# Altium schematic sheet IowaStateLEDSch.SchDoc
size A
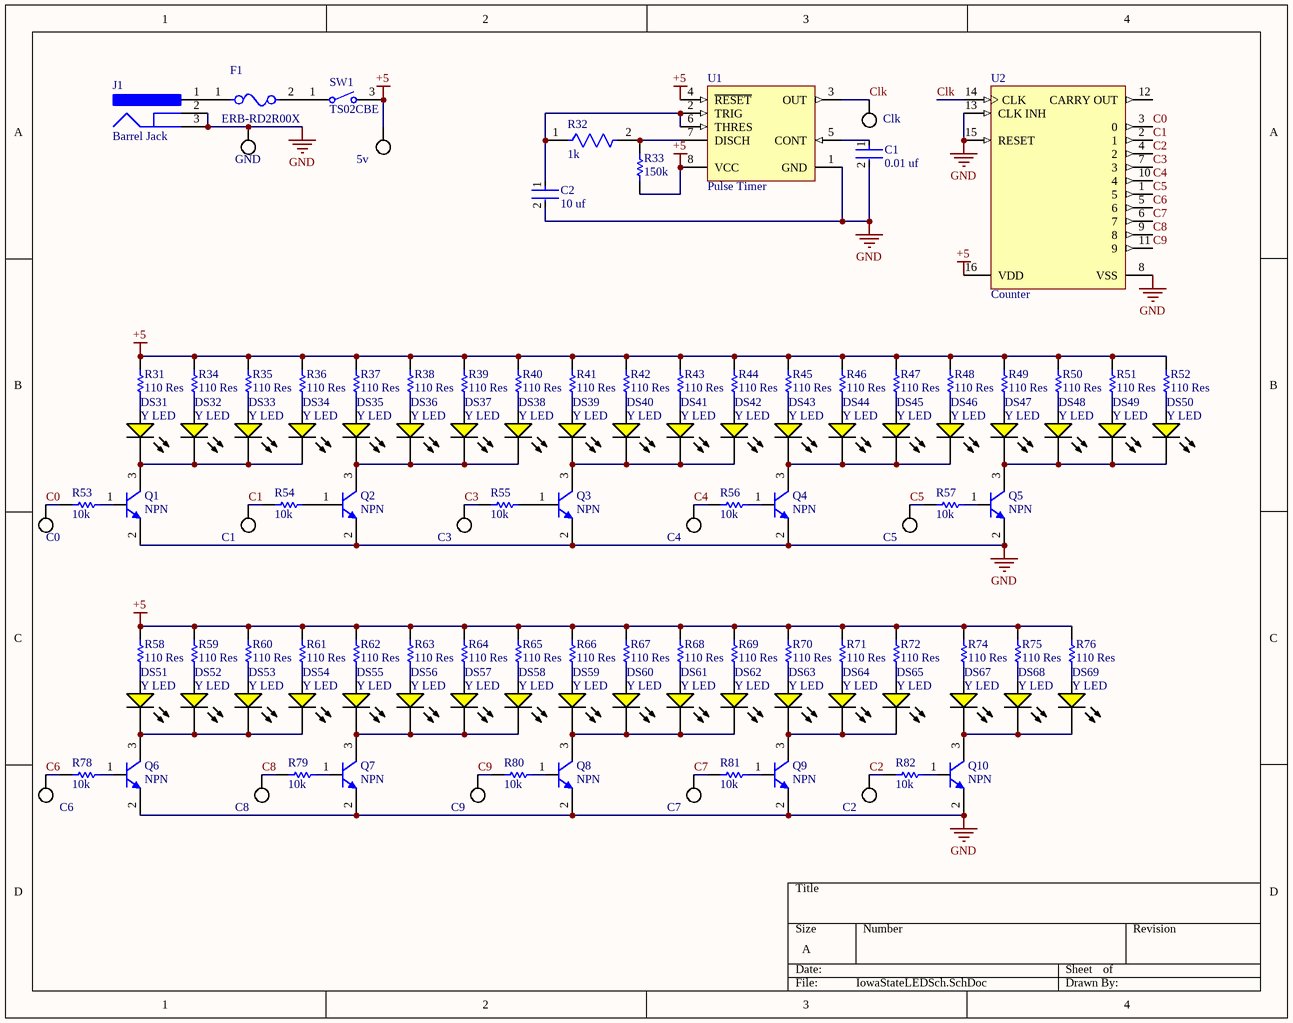
[diagram p0: IowaStateLEDSch.SchDoc]

## Parts
(Parts that share a designator on the sheet are numbered #1, #2 ... from top to bottom, then left to right.)
5v  EPAD  [EPAD]  (value not drawn)  (no BOM)
C0  EPAD  [EPAD]  (value not drawn)  (no BOM)
C1#1  0.01 uf  [FP-C1206C-EB-MFG]
C1#2  EPAD  [EPAD]  (value not drawn)  (no BOM)
C2#1  10 uf  [FP-CL21-IPC_C]
C2#2  EPAD  [EPAD]  (value not drawn)  (no BOM)
C3  EPAD  [EPAD]  (value not drawn)  (no BOM)
C4  EPAD  [EPAD]  (value not drawn)  (no BOM)
C5  EPAD  [EPAD]  (value not drawn)  (no BOM)
C6  EPAD  [EPAD]  (value not drawn)  (no BOM)
C7  EPAD  [EPAD]  (value not drawn)  (no BOM)
C8  EPAD  [EPAD]  (value not drawn)  (no BOM)
C9  EPAD  [EPAD]  (value not drawn)  (no BOM)
Clk  EPAD  [EPAD]  (value not drawn)  (no BOM)
DS31  Y LED  [LTST-C150KSKT_V]
DS32  Y LED  [LTST-C150KSKT_V]
DS33  Y LED  [LTST-C150KSKT_V]
DS34  Y LED  [LTST-C150KSKT_V]
DS35  Y LED  [LTST-C150KSKT_V]
DS36  Y LED  [LTST-C150KSKT_V]
DS37  Y LED  [LTST-C150KSKT_V]
DS38  Y LED  [LTST-C150KSKT_V]
DS39  Y LED  [LTST-C150KSKT_V]
DS40  Y LED  [LTST-C150KSKT_V]
DS41  Y LED  [LTST-C150KSKT_V]
DS42  Y LED  [LTST-C150KSKT_V]
DS43  Y LED  [LTST-C150KSKT_V]
DS44  Y LED  [LTST-C150KSKT_V]
DS45  Y LED  [LTST-C150KSKT_V]
DS46  Y LED  [LTST-C150KSKT_V]
DS47  Y LED  [LTST-C150KSKT_V]
DS48  Y LED  [LTST-C150KSKT_V]
DS49  Y LED  [LTST-C150KSKT_V]
DS50  Y LED  [LTST-C150KSKT_V]
DS51  Y LED  [LTST-C150KSKT_V]
DS52  Y LED  [LTST-C150KSKT_V]
DS53  Y LED  [LTST-C150KSKT_V]
DS54  Y LED  [LTST-C150KSKT_V]
DS55  Y LED  [LTST-C150KSKT_V]
DS56  Y LED  [LTST-C150KSKT_V]
DS57  Y LED  [LTST-C150KSKT_V]
DS58  Y LED  [LTST-C150KSKT_V]
DS59  Y LED  [LTST-C150KSKT_V]
DS60  Y LED  [LTST-C150KSKT_V]
DS61  Y LED  [LTST-C150KSKT_V]
DS62  Y LED  [LTST-C150KSKT_V]
DS63  Y LED  [LTST-C150KSKT_V]
DS64  Y LED  [LTST-C150KSKT_V]
DS65  Y LED  [LTST-C150KSKT_V]
DS67  Y LED  [LTST-C150KSKT_V]
DS68  Y LED  [LTST-C150KSKT_V]
DS69  Y LED  [LTST-C150KSKT_V]
F1  ERB-RD2R00X  [FP-ERBRD-MFG]
GND  EPAD  [EPAD]  (value not drawn)  (no BOM)
J1  Barrel Jack  [KYCN-KLDX-0202-A_V]
Q1  NPN  [DIOD-SOT23-3_V]
Q2  NPN  [DIOD-SOT23-3_V]
Q3  NPN  [DIOD-SOT23-3_V]
Q4  NPN  [DIOD-SOT23-3_V]
Q5  NPN  [DIOD-SOT23-3_V]
Q6  NPN  [DIOD-SOT23-3_V]
Q7  NPN  [DIOD-SOT23-3_V]
Q8  NPN  [DIOD-SOT23-3_V]
Q9  NPN  [DIOD-SOT23-3_V]
Q10  NPN  [DIOD-SOT23-3_V]
R31  110 Res  [RESC3216X70X50LL05T20]
R32  1k  [FP-CR1206-IPC_C]
R33  150k  [RESC3216X70X40LL20T20]
R34  110 Res  [RESC3216X70X50LL05T20]
R35  110 Res  [RESC3216X70X50LL05T20]
R36  110 Res  [RESC3216X70X50LL05T20]
R37  110 Res  [RESC3216X70X50LL05T20]
R38  110 Res  [RESC3216X70X50LL05T20]
R39  110 Res  [RESC3216X70X50LL05T20]
R40  110 Res  [RESC3216X70X50LL05T20]
R41  110 Res  [RESC3216X70X50LL05T20]
R42  110 Res  [RESC3216X70X50LL05T20]
R43  110 Res  [RESC3216X70X50LL05T20]
R44  110 Res  [RESC3216X70X50LL05T20]
R45  110 Res  [RESC3216X70X50LL05T20]
R46  110 Res  [RESC3216X70X50LL05T20]
R47  110 Res  [RESC3216X70X50LL05T20]
R48  110 Res  [RESC3216X70X50LL05T20]
R49  110 Res  [RESC3216X70X50LL05T20]
R50  110 Res  [RESC3216X70X50LL05T20]
R51  110 Res  [RESC3216X70X50LL05T20]
R52  110 Res  [RESC3216X70X50LL05T20]
R53  10k  [RESC3116X65X50NL20T20]
R54  10k  [RESC3116X65X50NL20T20]
R55  10k  [RESC3116X65X50NL20T20]
R56  10k  [RESC3116X65X50NL20T20]
R57  10k  [RESC3116X65X50NL20T20]
R58  110 Res  [RESC3216X70X50LL05T20]
R59  110 Res  [RESC3216X70X50LL05T20]
R60  110 Res  [RESC3216X70X50LL05T20]
R61  110 Res  [RESC3216X70X50LL05T20]
R62  110 Res  [RESC3216X70X50LL05T20]
R63  110 Res  [RESC3216X70X50LL05T20]
R64  110 Res  [RESC3216X70X50LL05T20]
R65  110 Res  [RESC3216X70X50LL05T20]
R66  110 Res  [RESC3216X70X50LL05T20]
R67  110 Res  [RESC3216X70X50LL05T20]
R68  110 Res  [RESC3216X70X50LL05T20]
R69  110 Res  [RESC3216X70X50LL05T20]
R70  110 Res  [RESC3216X70X50LL05T20]
R71  110 Res  [RESC3216X70X50LL05T20]
R72  110 Res  [RESC3216X70X50LL05T20]
R74  110 Res  [RESC3216X70X50LL05T20]
R75  110 Res  [RESC3216X70X50LL05T20]
R76  110 Res  [RESC3216X70X50LL05T20]
R78  10k  [RESC3116X65X50NL20T20]
R79  10k  [RESC3116X65X50NL20T20]
R80  10k  [RESC3116X65X50NL20T20]
R81  10k  [RESC3116X65X50NL20T20]
R82  10k  [RESC3116X65X50NL20T20]
SW1  TS02CBE  [CKCP-TS02CBE_V]
U1  Pulse Timer  [D0008A_M]
U2  Counter  [D0016A_L]

## Nets
+5: 5v.1 R31.1 R33.1 R34.1 R35.1 R36.1 R37.1 R38.1 R39.1 R40.1 R41.1 R42.1 R43.1 R44.1 R45.1 R46.1 R47.1 R48.1 R49.1 R50.1 R51.1 R52.1 R58.1 R59.1 R60.1 R61.1 R62.1 R63.1 R64.1 R65.1 R66.1 R67.1 R68.1 R69.1 R70.1 R71.1 R72.1 R74.1 R75.1 R76.1 SW1.3 U1.4(~{RESET}) U1.8(VCC) U2.16(VDD)
GND: C1#1.2 C2#1.2 GND.1 J1.2 J1.3 Q1.2(E) Q2.2(E) Q3.2(E) Q4.2(E) Q5.2(E) Q6.2(E) Q7.2(E) Q8.2(E) Q9.2(E) Q10.2(E) U1.1(GND) U2.8(VSS) U2.13(CLK_INH) U2.15(RESET)
C0: C0.1 R53.1 U2.3(0)
C1: C1#2.1 R54.1 U2.2(1)
C2: C2#2.1 R82.1 U2.4(2)
C3: C3.1 R55.1 U2.7(3)
C4: C4.1 R56.1 U2.10(4)
C5: C5.1 R57.1 U2.1(5)
C6: C6.1 R78.1 U2.5(6)
C7: C7.1 R81.1 U2.6(7)
C8: C8.1 R79.1 U2.9(8)
C9: C9.1 R80.1 U2.11(9)
Clk: Clk.1 U1.3(OUT) U2.14(CLK)
NetC1#1_1: C1#1.1 U1.5(CONT)
NetC2#1_1: C2#1.1 R32.1 U1.2(TRIG) U1.6(THRES)
NetDS31_1: DS31.1(A) R31.2
NetDS31_2: DS31.2(K) DS32.2(K) DS33.2(K) DS34.2(K) Q1.3(C)
NetDS32_1: DS32.1(A) R34.2
NetDS33_1: DS33.1(A) R35.2
NetDS34_1: DS34.1(A) R36.2
NetDS35_1: DS35.1(A) R37.2
NetDS35_2: DS35.2(K) DS36.2(K) DS37.2(K) DS38.2(K) Q2.3(C)
NetDS36_1: DS36.1(A) R38.2
NetDS37_1: DS37.1(A) R39.2
NetDS38_1: DS38.1(A) R40.2
NetDS39_1: DS39.1(A) R41.2
NetDS39_2: DS39.2(K) DS40.2(K) DS41.2(K) DS42.2(K) Q3.3(C)
NetDS40_1: DS40.1(A) R42.2
NetDS41_1: DS41.1(A) R43.2
NetDS42_1: DS42.1(A) R44.2
NetDS43_1: DS43.1(A) R45.2
NetDS43_2: DS43.2(K) DS44.2(K) DS45.2(K) DS46.2(K) Q4.3(C)
NetDS44_1: DS44.1(A) R46.2
NetDS45_1: DS45.1(A) R47.2
NetDS46_1: DS46.1(A) R48.2
NetDS47_1: DS47.1(A) R49.2
NetDS47_2: DS47.2(K) DS48.2(K) DS49.2(K) DS50.2(K) Q5.3(C)
NetDS48_1: DS48.1(A) R50.2
NetDS49_1: DS49.1(A) R51.2
NetDS50_1: DS50.1(A) R52.2
NetDS51_1: DS51.1(A) R58.2
NetDS51_2: DS51.2(K) DS52.2(K) DS53.2(K) DS54.2(K) Q6.3(C)
NetDS52_1: DS52.1(A) R59.2
NetDS53_1: DS53.1(A) R60.2
NetDS54_1: DS54.1(A) R61.2
NetDS55_1: DS55.1(A) R62.2
NetDS55_2: DS55.2(K) DS56.2(K) DS57.2(K) DS58.2(K) Q7.3(C)
NetDS56_1: DS56.1(A) R63.2
NetDS57_1: DS57.1(A) R64.2
NetDS58_1: DS58.1(A) R65.2
NetDS59_1: DS59.1(A) R66.2
NetDS59_2: DS59.2(K) DS60.2(K) DS61.2(K) DS62.2(K) Q8.3(C)
NetDS60_1: DS60.1(A) R67.2
NetDS61_1: DS61.1(A) R68.2
NetDS62_1: DS62.1(A) R69.2
NetDS63_1: DS63.1(A) R70.2
NetDS63_2: DS63.2(K) DS64.2(K) DS65.2(K) Q9.3(C)
NetDS64_1: DS64.1(A) R71.2
NetDS65_1: DS65.1(A) R72.2
NetDS67_1: DS67.1(A) R74.2
NetDS67_2: DS67.2(K) DS68.2(K) DS69.2(K) Q10.3(C)
NetDS68_1: DS68.1(A) R75.2
NetDS69_1: DS69.1(A) R76.2
NetF1_1: F1.1 J1.1
NetF1_2: F1.2 SW1.1
NetQ1_1: Q1.1(B) R53.2
NetQ2_1: Q2.1(B) R54.2
NetQ3_1: Q3.1(B) R55.2
NetQ4_1: Q4.1(B) R56.2
NetQ5_1: Q5.1(B) R57.2
NetQ6_1: Q6.1(B) R78.2
NetQ7_1: Q7.1(B) R79.2
NetQ8_1: Q8.1(B) R80.2
NetQ9_1: Q9.1(B) R81.2
NetQ10_1: Q10.1(B) R82.2
NetR32_2: R32.2 R33.2 U1.7(DISCH)

Not connected (* = marked no-connect by the designer): U2 12(CARRY_OUT)

## Library data of the parts
5v C0 C1#2 C2#2 C3-C9 Clk GND = EPAD: Pad for probing signals
C1#1 = CMP-03020-025386-1: C1206 10,000 pF X7R 10.00% 50 V; Manufacturer: KEMET; Manufacturer Part Number: C1206C103K5RAC; Temperature Coefficient: 15%; Automotive Grade: Grade 0; Tolerance: 0.1; Material: Ceramic; Voltage Rating: 50 V; Ipc Land Pattern Name: CAPC320160X78; Lead Free: Yes; Height: 0.88mm; Temperature: -55°C to +150°C; ComponentLink2URL: https://content.kemet.com/datasheets/KEM_C1007_X8R_ULTRA_150C_SMD.pdf; Temperature Characteristic: X7R; RoHS: TRUE; Value: 10,000 pF; Mouser Description: Cap Ceramic 0.01uF 50V X7R 10% Pad SMD 1206 125C Bulk; Capacitance: 10,000 pF; Octopart: https://octopart.com/c1206c103k5rac-kemet-1311444; Temperature Range Low: -55°C; Category: Cap; Temperature Range High: +150°C; Package: C1206C-EB; Device Class L2: Capacitors; Automotive: Yes; Device Class L1: Passive Components; ComponentLink2Description: Datasheet; Device Class L3: Ceramic Capacitors
C2#1 = CMP-13271-001427-1: CL21 Series 0805 10uF 6.3V ±10% Tolerance X7R Multilayer Ceramic Chip Capacitor; Min Operating Temperature: -55°C; Capacitance: 10uF; Dielectric: X7R; Voltage Rating: 6.3V; Case/Package: 0805; Height: 1.25mm; Case Code (Metric): 2012; Tolerance: 10%; Packaging: Tape and Reel; Thickness: 0.055inch; Voltage: 6.3V; Max Operating Temperature: 125°C; Lead Free: Lead Free; Package Quantity: 3000; Case Code (Imperial): 0805; Depth: 1.25mm; Width: 0.049inch; Length: 2mm; Mount: Surface Mount; ComponentLink1Description: Digikey order; ComponentLink1URL: https://www.digikey.com/en/products/detail/CL21B106KQQNNNG/1276-6474-1-ND/5958102?utm_campaign=buynow&utm_medium=aggregator&curr=usd&utm_source=octopart
DS31-DS65 DS67-DS69 = CMP-2000-06618-1: LED Yellow, 75 mW, 80 mA, -55 to 85 degC, 2-Pin SMD, RoHS, Tape and Reel; Manufacturer: Lite-On; Forward Current: 30mA; Product Depth (mm): 1.6mm; DELETED: Compliant; Product Length (mm): 3.2mm; Type: Uni-Color; Product Height (mm): 1.1mm; Viewing Angle: 130deg; Number of  Elements: 1; Main Category: ChipLED; Forward Voltage: 2.4V; Test Current (It): 20mA; Shape Type: Rectangular; Chip Material: AlGaInP; Rad Hardened: No; Emitting Color: Amber; Luminous Intensity: 60mcd; High Brightness: Yes; Dominant Wave Length: 587nm; Reverse Voltage: 5V; Peak Wavelength: 588nm; Power Dissipation: 75W; Packaging: TapeandReel; Lens Dimensions: 2.06X1.6X0.6mm; Operating Temp Range: -55Cto85C; Pin Count: 2; Datasheet Version: Rev. E, 02/2005; Package Description: 2-Pin Surface Mount Device, Body 3.2 x 1.6 mm; Mounting: SurfaceMount; Datasheet URL: http://optoelectronics.liteon.com/upload/download/DS-22-99-0187/S_110_LTST-C150KSKT.pdf; Package Reference: C150KSKT; Manufacturer URL: http://www.us.liteon.com/; Operating Temperature Classification: Industrial; Package Type: ChipLed; Mounting Technology: SurfaceMount; Lum Intensity: 60mcd
F1 = CMP-05590-000001-1: FUSE BOARD MOUNT 2A 32VDC 0402; Manufacturer: Panasonic Electronic Components; Resistance: 53mΩ; Value: 53mΩ; Voltage Rating: 32V; Fuse Interrupt Dc Current: 35A; Fuse Blow Speed: Fast; Digikey Description: FUSE BOARD MOUNT 2A 32VDC 0402; ComponentLink2Description: Datasheet; Fuse Current: 2A; Device Class L2: Fuses; Category: Fuse; Octopart: https://octopart.com/erb-rd2r00x-panasonic-21220532; RoHS: TRUE; Device Class L1: Circuit Protection; Temperature Range High: +125°C; Height: 0.49mm; Device Class L3: unset; Max Fuse Dc Voltage: 32V; Automotive: No; Manufacturer Part Number: ERB-RD2R00X; Lead Free: Yes; Temperature Range Low: -40°C; Mouser Description: Surface Mount Fuses 2A 0402 micro chip; ComponentLink2URL: https://industrial.panasonic.com/cdbs/www-data/pdf/AFA0000/AFA0000C7.pdf; Temperature: -40°C to +125°C; Package: ERBRD
J1 = CMP-1673-00001-5: DC Power Jack, 24 V, 3.5 A, -25 to 85 degC, 3-Pin THD, RoHS; Manufacturer: Kycon; Voltage Rating: 24 V; Current Rating: 3.5 A; Height: 10.8 mm; Length: 9.2 mm; Pins: 2; Housing Material: PBT; Connector Type: Power; ComponentLink2URL: http://www.kycon.com/Pub_Eng_Draw/KLDX-0202-X.PDF; PackageDescription: 3-Pin Through Hole Device, Body 14.5 x 9 mm; Max Operating Temperature: 85 degC; Min Operating Temperature: -25 degC; PackageReference: KLDX-0202-A; Contact Gender: Female; Package Quantity: 500; Mount: Through Hole; Colour: Black; Contact Plating: Tin; DatasheetVersion: Rev. D3, 06/2013; ComponentLink2Description: Datasheet; RoHSCompliant: true; Mounting Technology: Through Hole; ComponentLink1Description: Manufacturer URL; Contact Material: Brass; ComponentLink1URL: http://www.kycon.com/; ComponentLink3Description: Wall Adapter; ComponentLink3URL: https://www.digikey.com/en/products/detail/xp-power/VEL05US050-US-JA/5023713
Q1-Q10 = CMP-1693-00003-3: NPN Small Signal Transistor, 40 V, -55 to 150 degC, 3-Pin SOT23, RoHS, Tape and Reel; PartNumber: MMBT2222A-7-F; Weight: 0.000282 oz; Mounting Technology: Surface Mount; Mount: Surface Mount; PackageDescription: 3-Pin Small Outline Transistor, Body 2.9 x 1.3 mm, Pitch 0.95 mm; Case/Package: SOT-23; Min Operating Temperature: -55 degC; ComponentLink1Description: Manufacturer URL; Height: 1.1 mm; Packaging: Tape and Reel; REACH SVHC: No SVHC; RoHSCompliant: True; Width: 1.4 mm; ComponentLink1URL: http://www.diodes.com/; Pins: 3; Length: 3 mm; Radiation Hardening: No; Package Quantity: 3000; DatasheetVersion: Rev. 16 - 2; ComponentLink2URL: http://www.diodes.com/_files/datasheets/ds30041.pdf; Max Operating Temperature: 150 degC; ComponentLink2Description: Datasheet
R31 R34-R52 R58-R72 R74-R76 = CMP-2003-00040-1: Part Number: ERJ-8ENF1100V; Manufacturer: Panasonic
R32 = CMP-07231-001820-1: Thick Film Chip Resistors 1206 1kΩ 0.25W 5% 200ppm/°C; Voltage Rating: 200V; Resistance: 1kR; Power Rating: 250mW; Number of Pins: 2; Packaging: Tape and Reel; Termination: SMD/SMT; Case Code (Imperial): 1206; Radiation Hardening: No; Height: 0.6mm; Temperature Coefficient: 200ppm/°C; Mount: Surface Mount; Case Code (Metric): 3216; Case/Package: 1206; Thickness: 610um; Voltage Rating (DC): 200V; Military Standard: Not; Width: 1.6mm; Min Operating Temperature: -55°C; Length: 3.2mm; Depth: 1.6mm; REACH SVHC: No SVHC; Contact Plating: Tin; Tolerance: 5%; Package Quantity: 5000; Composition: Thick Film; Max Operating Temperature: 155°C
R33 = CMP-2003-04546-1: Part Number: RK73B2BTTD154J; Manufacturer: KOA Speer
R53-R57 R78-R82 = CMP-2003-04883-1: Part Number: CRCW120610K0FKEAHP; Manufacturer: Vishay Dale
SW1 = CMP-2000-07317-1: Tiny Slide Switch, SPST, 20 V, -30 to 85 degC, 2-Pin THD, RoHS, Bulk; Manufacturer: C&K Components; Product Height (mm): 12.91mm; Actuator Style: TopSlide; Product Length (mm): 10.16mm; Switch Configuration: OFFNoneON; AC Voltage Rating (Max): 20V; Product Depth (mm): 5.08mm; Actuator Material: Nylon; Mounting Technology: ThroughHole; Manufacturer URL: http://www.ckswitches.com/; Type: Tiny; Pole Throw Configuration: SPST; Terminal Type: PCPins; Package Reference: TS02CBE; Package Description: 2-Pin Through Hole Device, Body 10.16 x 5.08 mm; Datasheet Version: 02/2016; Datasheet URL: http://www.ck-components.com/media/1426/ts_12feb16.pdf; Contact Material: CopperAlloy; Housing Material: N/A/StainlessSteel; Operating Temp Range: -30Cto85C; Contact Plating: Gold/Nickel; DC Voltage Rating (Max): 20V; Mounting Style: ThroughHole
U1 = CMP-1685-00007-1: Precision Timer, 4.5 to 16 V, 0 to 70 degC, 8-Pin SOIC (D8), Green (RoHS & no Sb/Br), Tape and Reel; Forward Voltage: 450 mV; Forward Current: 1 A; Max Surge Current: 30 A; Peak Reverse Current: 500 uA; Case\Package: SMA; PackageReference: D0008A; Width: 2.84 mm; PackageDescription: 8-Pin Small Outline Integrated Circuit, Body 4.9 x 3.9 mm, Pitch 1.27 mm; DatasheetVersion: SLFS022I, 09/2014; ComponentLink2Description: Datasheet; Package Quantity: 1; REACH SVHC: Unknown; Radiation Hardening: No; Height: 2.44 mm; Code_JEDEC: MS-012; Pins: 2; ComponentLink1Description: Manufacturer URL; ComponentLink3Description: Package Specification; ComponentLink3URL: http://www.ti.com/lit/ml/msoi002j/msoi002j.pdf; Length: 4.57 mm; ComponentLink1URL: http://www.ti.com/; Mount: Surface Mount; PackageVersion: 4040047-3/M, 06/2011; ComponentLink2URL: http://www.ti.com/general/docs/lit/getliterature.tsp?genericPartNumber=NE555&fileType=pdf; RoHSCompliant: true; Max Operating Temperature: 125 degC; Packaging: Cut Tape; Min Operating Temperature: -55 degC
U2 = CMP-1623-00072-2: CMOS Decade Counter with 10 Decoded Outputs, D0016A, LARGE T&R; Generic Part Number: CD4017B; Manufacturer: Texas Instruments; Technology Family: CD4000; Schmitt Trigger: No; VCC(Max)(V): 18; Inputs: 1; tpd @ Nom Voltage(Max)(ns): 270; Rating: Military; Bits(#): 10; Output Drive (IOL/IOH)(Max)(mA): 1.5/-1.5; ICC @ Nom Voltage(Max)(mA): 0.03; F @ Nom Voltage(Max)(Mhz): 8; VCC(Min)(V): 3; Output Type: CMOS; Operating Temperature Range(C): -55 to 125; Type: Decade; DatasheetVersion: SCHS027C; Input Type: CMOS; Function: Counter; PackageReference: D0016A; Code_JEDEC: MS-012 variation AC; Voltage(Nom)(V): 10